# EasyEDA Pro project ProPrj_SW4_poor.epro

# Schematic Schematic1_1

## Sheets
1 CH334R: Create Date: 2024-02-01; Page Name: CH334R; Project Name: SW4_poor; Schematic Name: Schematic1; Update Date: 2024-02-01; Company: 嘉立创EDA; Page Size: A4; Version: V1.0
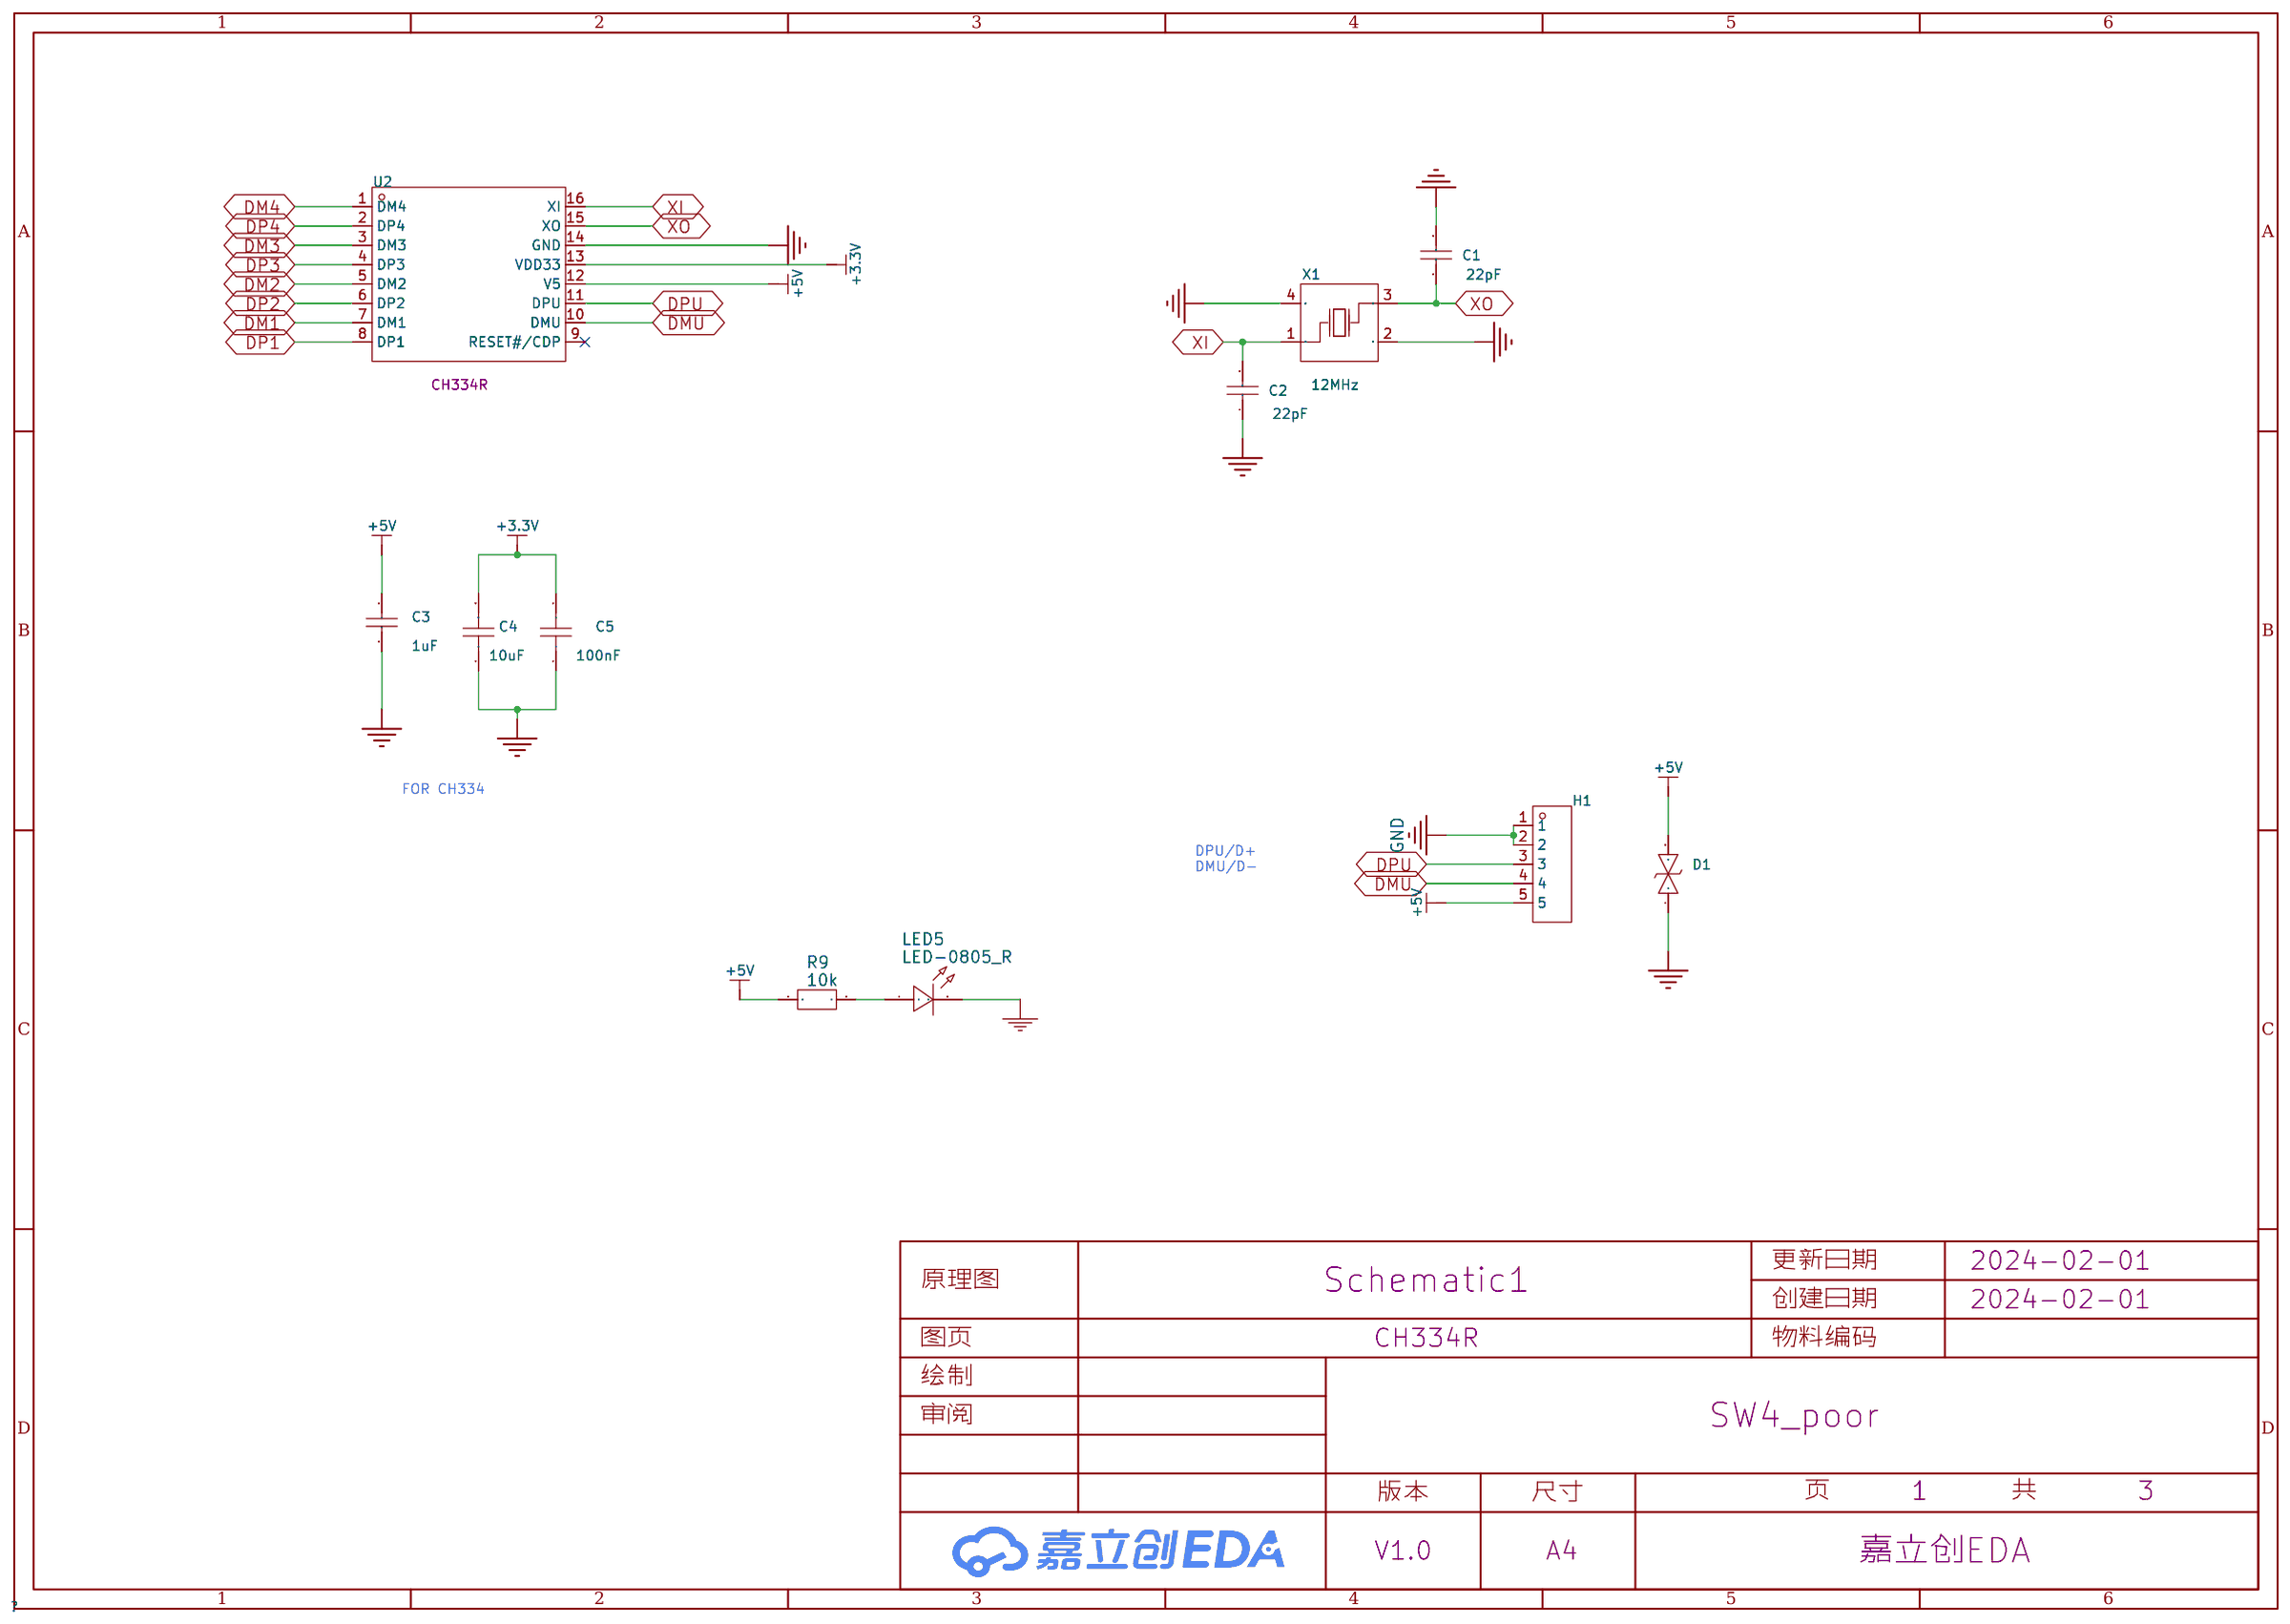
[diagram p0: CH334R]
2 E73-2G4M08S1C: Board Name: Board1_1; Create Date: 2024-02-28; Page Name: E73-2G4M08S1C; Schematic Name: Schematic1_1; Update Date: 2024-02-28
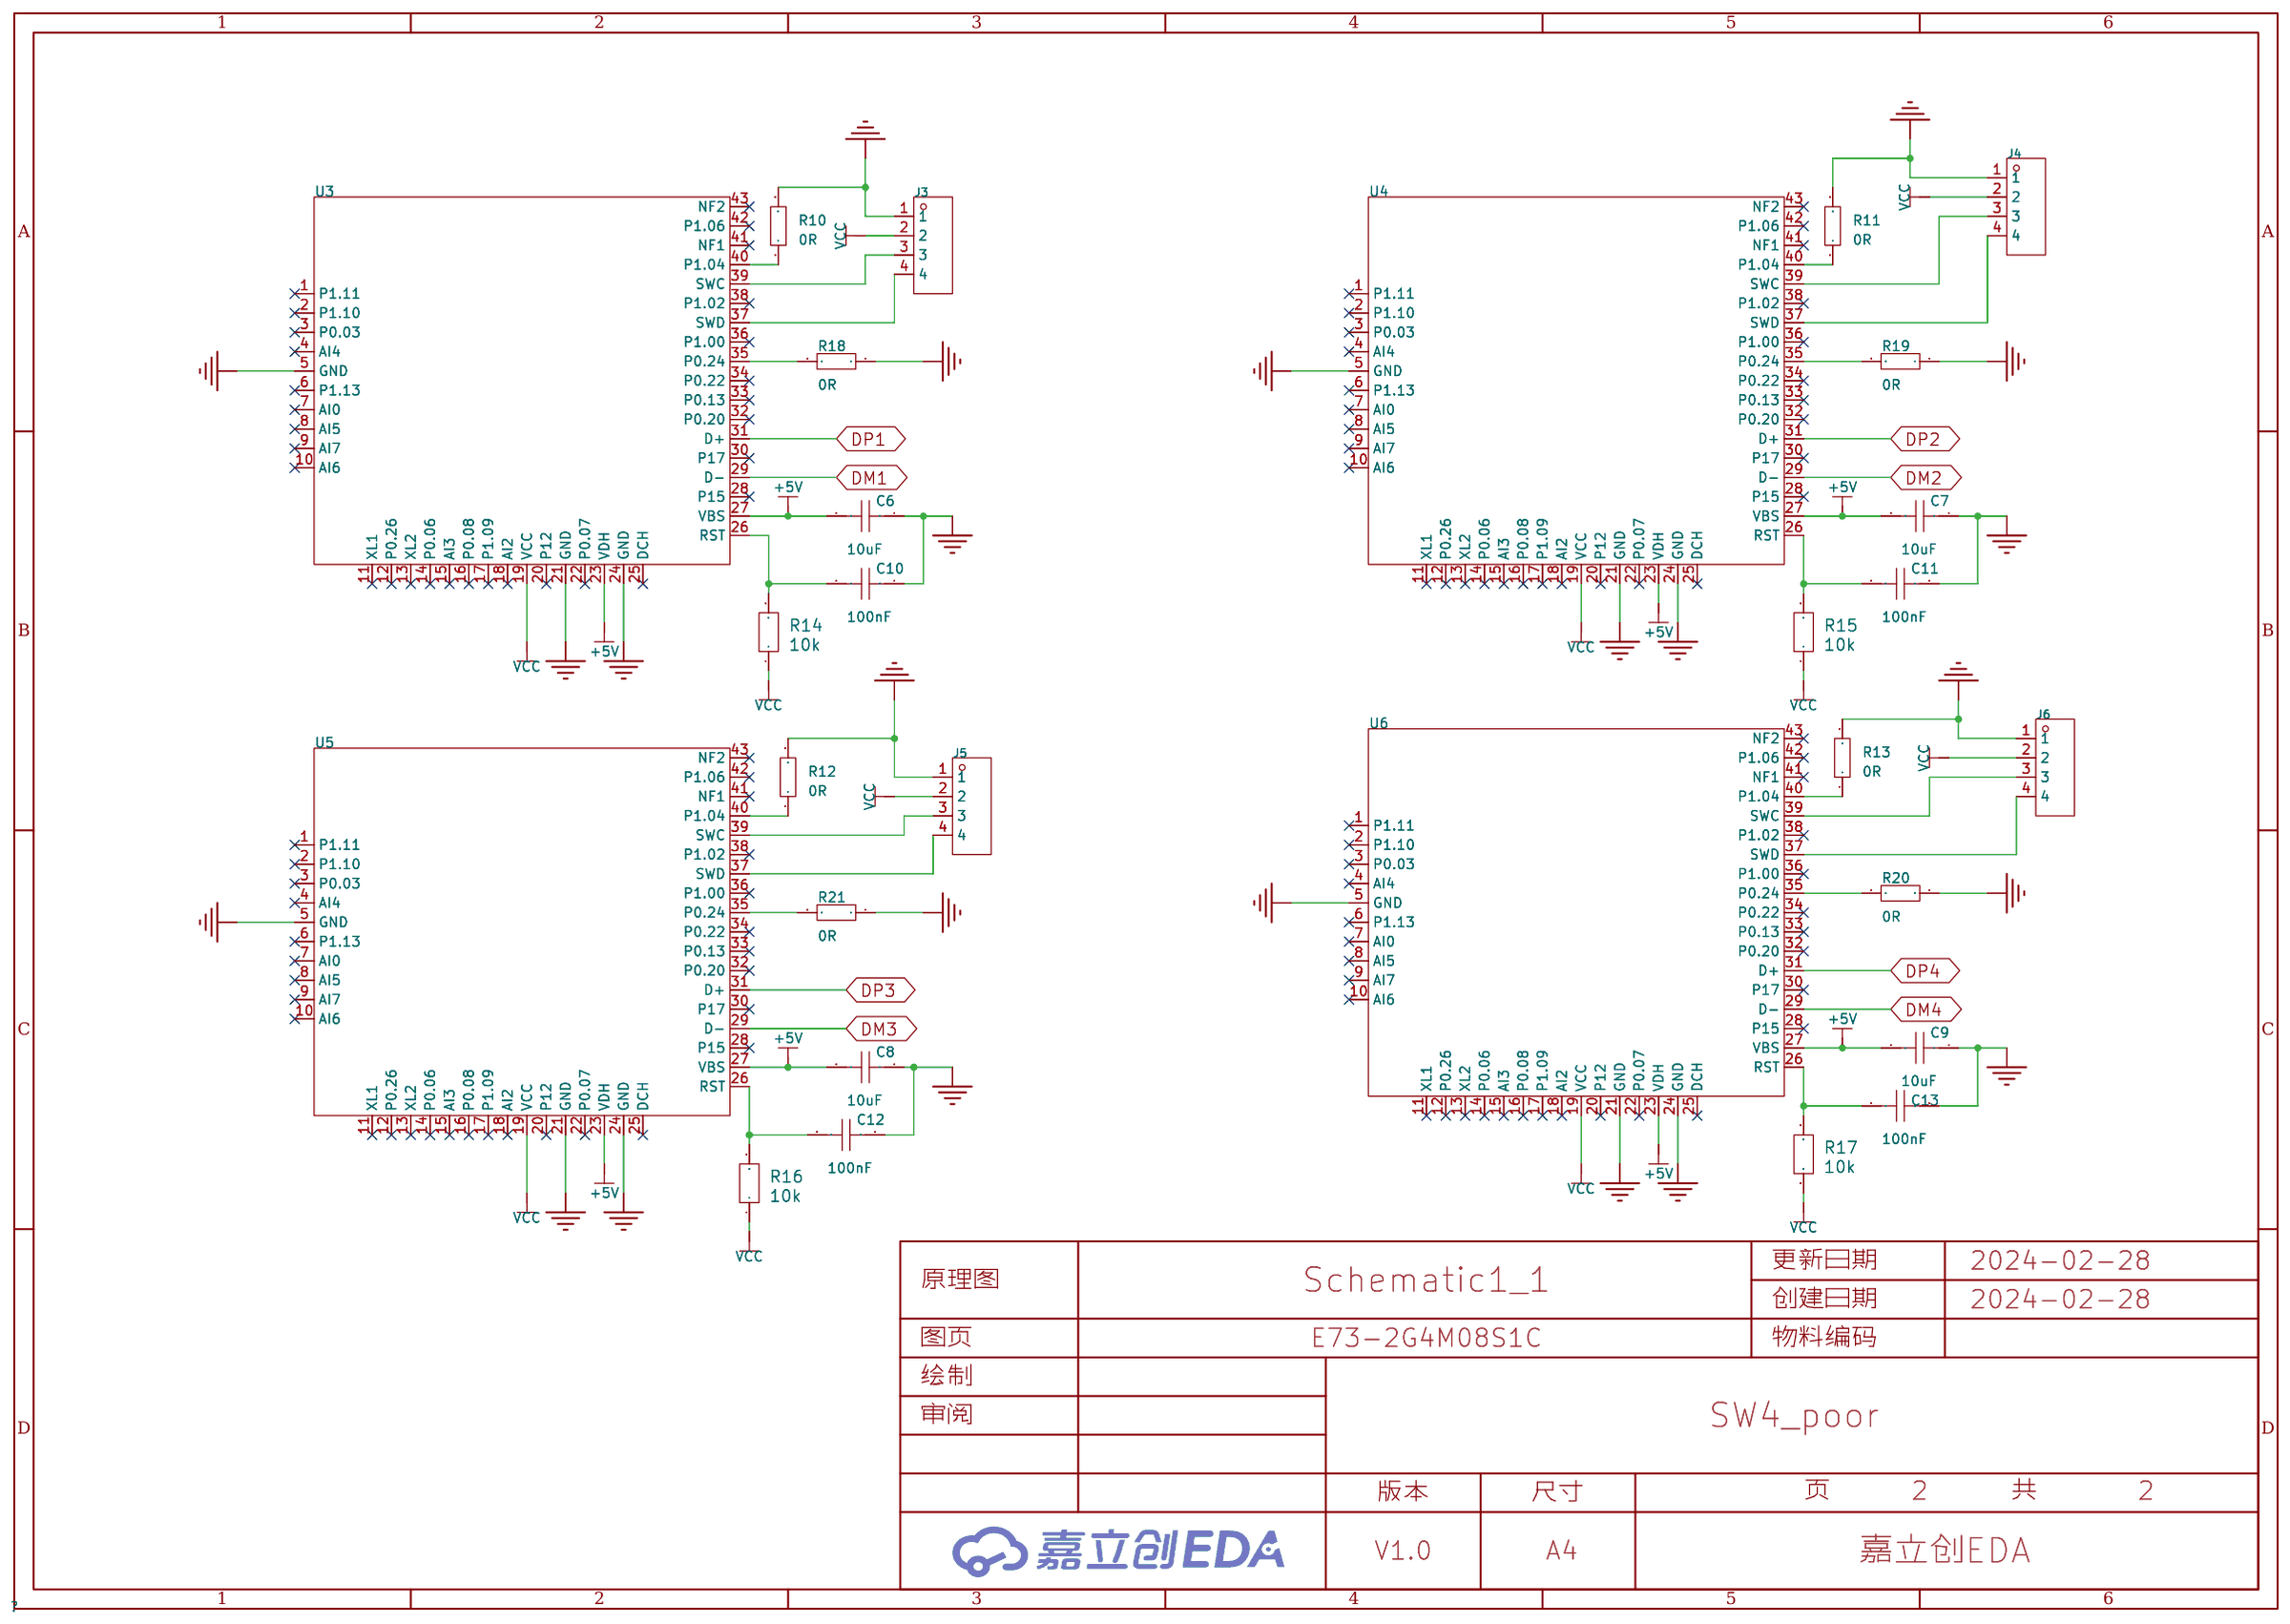
[diagram p1: E73-2G4M08S1C]

## Parts
sheet CH334R
C1  22pF  [C0603]
C2  22pF  [C0603]
C3  1uF  [C0603]
C4  10uF  [C0603]
C5  100nF  [C0603]
D1  SMF5.0CA  [SOD-123_L2.7-W1.8-LS3.7-BI]
H1  BX-PH2.0-5PWZ  [CONN-TH_5P-P2.00_BX-PH2.0-5PWZ]
LED5  LED-0805_R  [LED0805_RED]
R9  10k  [R0603]
U2  CH334R  [QSOP-16_L4.9-W3.9-P0.64-LS6.0-BL]
X1  12MHz  [OSC-SMD_4P-L3.2-W2.5-BL]
sheet E73-2G4M08S1C
C6  10uF  [C0603]
C7  10uF  [C0603]
C8  10uF  [C0603]
C9  10uF  [C0603]
C10  100nF  [C0603]
C11  100nF  [C0603]
C12  100nF  [C0603]
C13  100nF  [C0603]
J3  2.54-4P ZZDK  [CONN-TH_4P-P2.54_POGOPIN-2.5-4P-F]
J4  2.54-4P ZZDK  [CONN-TH_4P-P2.54_POGOPIN-2.5-4P-F]
J5  2.54-4P ZZDK  [CONN-TH_4P-P2.54_POGOPIN-2.5-4P-F]
J6  2.54-4P ZZDK  [CONN-TH_4P-P2.54_POGOPIN-2.5-4P-F]
R10  0R  [R0402]
R11  0R  [R0402]
R12  0R  [R0402]
R13  0R  [R0402]
R14  10k  [R0603]
R15  10k  [R0603]
R16  10k  [R0603]
R17  10k  [R0603]
R18  0R  [R0402]
R19  0R  [R0402]
R20  0R  [R0402]
R21  0R  [R0402]
U3  E73-2G4M08S1C  [WIRELM-SMD_E73-2G4M08S1C]
U4  E73-2G4M08S1C  [WIRELM-SMD_E73-2G4M08S1C]
U5  E73-2G4M08S1C  [WIRELM-SMD_E73-2G4M08S1C]
U6  E73-2G4M08S1C  [WIRELM-SMD_E73-2G4M08S1C]

## Library data of the parts
C1 C2 = CL10C220JB8NNNC: 容值:22pF;精度:±5%;额定电压:50V;材质(温度系数):C0G;; LCSC Part Name: 22pF ±5% 50V; Supplier Part: C1653; Manufacturer: SAMSUNG(三星); Supplier Footprint: 0603; JLCPCB Part Class: Basic Part; Datasheet: https://atta.szlcsc.com/upload/public/pdf/source/20160103/1457707687317.pdf; Supplier: LCSC; Tolerance: ±5%; Voltage Rated: 50V; Temperature Coefficient: C0G
C3 = CL10A105KB8NNNC: 容值:1uF;精度:±10%;额定电压:50V;材质(温度系数):X5R;; LCSC Part Name: 1uF ±10% 50V; Supplier Part: C15849; Manufacturer: SAMSUNG(三星); Supplier Footprint: 0603; JLCPCB Part Class: Basic Part; Datasheet: https://atta.szlcsc.com/upload/public/pdf/source/20160103/1457707679084.pdf; Supplier: LCSC; Tolerance: ±10%; Voltage Rated: 50V; Temperature Coefficient: X5R
C4 C6-C13 = CL10A106KP8NNNC: 容值:10uF;精度:±10%;额定电压:10V;材质(温度系数):X5R;; LCSC Part Name: 10uF ±10% 10V; Supplier Part: C19702; Manufacturer: SAMSUNG(三星); Supplier Footprint: 0603; JLCPCB Part Class: Basic Part; Datasheet: https://atta.szlcsc.com/upload/public/pdf/source/20160103/1457707703378.pdf; Supplier: LCSC; Tolerance: ±10%; Voltage Rated: 10V; Temperature Coefficient: X5R
C5 = CC0603KRX7R9BB104: 容值:100nF;精度:±10%;额定电压:50V;材质(温度系数):X7R;; LCSC Part Name: 100nF ±10% 50V; Supplier Part: C14663; Manufacturer: YAGEO(国巨); Supplier Footprint: 0603; JLCPCB Part Class: Basic Part; Datasheet: https://atta.szlcsc.com/upload/public/pdf/source/20170116/1484561234239.pdf; Supplier: LCSC; Tolerance: ±10%; Voltage Rated: 50V; Temperature Coefficient: X7R
D1 = SMF5.0CA: 极性:双向;反向截止电压(Vrwm):5V;击穿电压:6.4V;反向漏电流(Ir):800uA;峰值脉冲电流(Ipp)@10/1000μs:21.7A;最大钳位电压:9.2V;; LCSC Part Name: 双向 Vrwm:5V; Supplier Part: C435453; Manufacturer: AnBon(安邦); Supplier Footprint: SOD-123; JLCPCB Part Class: Extended Part; Datasheet: https://atta.szlcsc.com/upload/public/pdf/source/20191009/C435453_6D1091435A92BAD2FCEBAFDAD46121CC.pdf; Supplier: LCSC; Polarity: 双向; Reverse Stand-Off Voltage (Vrwm): 5V; Breakdown Voltage (Min): 6.4V; Breakdown Voltage (Max): 7.25V; Reverse Leakage Current (Ir): 800uA; Peak Pulse Current (Ipp)@10/1000μs: 21.7A; Maximum Clamping Voltage: 9.2V; Peak Pulse Power Dissipation (Ppp)@10/1000μs: 200W; Breakdown Voltage: 6.4V
H1 = BX-PH2.0-5PWZ: 插针结构:1x5P;间距:2mm;安装方式:弯插;参考系列:PH;总PIN数:5P;排数:1;每排PIN数:5;行距:-;额定电流:2A;触头材质:黄铜;触头镀层:锡;工作温度范围:-25℃~+85℃;; Supplier Part: C18077756; Manufacturer: Bossie(博锡); Supplier Footprint: 弯插,P=2mm; Datasheet: https://atta.szlcsc.com/upload/public/pdf/source/20231017/425E996C8D405406F1741D45DB812287.pdf; Supplier: LCSC; Pins Structure: 1x5P; Pitch: 2mm; Mounting Style: 弯插; Reference Series: PH; Number of Pins: 5P; Number of Rows: 1; Number of PINs Per Row: 5; Current Rating (Max): 2A; Contact Material: 黄铜; Contact Plating: 锡; Operating Temperature Range: -25℃~+85℃
LED5 = LED-0805_R: 3DModel: LED0805_Red; Manufacturer: EVERLIGHT(台湾亿光); Manufacturer Part: 17-21SURC/S530-A3/TR8; Supplier Part: C72037
R9 R14-R17 = 1k: link: https://item.szlcsc.com/142685.html; 3DModel: R0805_L2.0-W1.3-H0.6
U2 = CH334R: Supplier Part: C4154405; Manufacturer: WCH(南京沁恒); Supplier Footprint: QSOP-16-150mil; JLCPCB Part Class: 扩展库; Supplier: LCSC
X1 = X322512MOB4SI: 晶振类型:贴片无源晶振;频率:12MHz;频率公差:±10ppm;频率稳定度:±30ppm;负载电容:12pF;工作温度:-40℃~+85℃;; LCSC Part Name: 12MHz ±10ppm 12pF; Supplier Part: C70565; Manufacturer: YXC(扬兴晶振); Supplier Footprint: SMD3225-4P; JLCPCB Part Class: Extended Part; Datasheet: https://atta.szlcsc.com/upload/public/pdf/source/20210329/C112971_1F611BDC486E193C1706F6D8EB5AA189.pdf; Supplier: LCSC; Crystal Type: 贴片无源晶振; Frequency Tolerance: ±10ppm; Frequency Stability: ±30ppm; Load Capacitance: 12pF; Operating Temperature: -40℃~+85℃
J3-J6 = 2.54-4P ZZDK: 插针结构:1x4P;间距:2.5mm;安装方式:直插;总PIN数:4P;排数:1;每排PIN数:4;参考系列:XH;额定电流:3A;触头材质:黄铜;触头镀层:锡;工作温度范围:-25℃~+85℃;; LCSC Part Name: 1x4P 间距:2.5mm 直插 系列:XH; Supplier Part: C18185651; Manufacturer: SHOU HAN(首韩); Supplier Footprint: 插件,P=2.5mm; JLCPCB Part Class: 扩展库; Datasheet: https://atta.szlcsc.com/upload/public/pdf/source/20230919/5CCBE7408303C792D3A62491FEFF5508.pdf; Supplier: LCSC; Pins Structure: 1x4P; Pitch: 2.5mm; Mounting Style: 直插; Number of Pins: 4P; Number of Rows: 1; Number of PINs Per Row: 4; Reference Series: XH; Current Rating (Max): 3A; Contact Material: 黄铜; Contact Plating: 锡; Operating Temperature Range: -25℃~+85℃
R10-R13 R18-R21 = Res_0603: Supplier Footprint: 0603
U3-U6 = E73-2G4M08S1C: nRF52840 BLE Module 低功耗蓝牙; Supplier Part: C356849; Manufacturer: EBYTE(亿佰特); Supplier Footprint: Module; JLCPCB Part Class: 扩展库; Datasheet: https://atta.szlcsc.com/upload/public/pdf/source/20190802/C356849_057FD2ABDA7635054C2E243A545E6C9F.pdf; Supplier: LCSC

## Nets
+3.3V: C4.2 C5.2 U2.13(VDD33)
+5V: C3.2 C6.2 C7.2 C8.2 C9.2 D1.2 H1.5 R9.1 U2.12(V5) U3.23(VDH) U3.27(VBS) U4.23(VDH) U4.27(VBS) U5.23(VDH) U5.27(VBS) U6.23(VDH) U6.27(VBS)
GND: C1.2 C2.1 C3.1 C4.1 C5.1 C6.1 C7.1 C8.1 C9.1 C10.1 C11.1 C12.1 C13.1 D1.1 H1.1 H1.2 J3.1 J4.1 J5.1 J6.1 LED5.2 R10.2 R11.2 R12.2 R13.2 R18.1 R19.1 R20.1 R21.1 U2.14(GND) U3.5(GND) U3.21(GND) U3.24(GND) U4.5(GND) U4.21(GND) U4.24(GND) U5.5(GND) U5.21(GND) U5.24(GND) U6.5(GND) U6.21(GND) U6.24(GND) X1.2(GND) X1.4(GND)
VCC: J3.2 J4.2 J5.2 J6.2 R14.1 R15.1 R16.1 R17.1 U3.19(VCC) U4.19(VCC) U5.19(VCC) U6.19(VCC)
DM1: U2.7(DM1) U3.29(D-)
DM2: U2.5(DM2) U4.29(D-)
DM3: U2.3(DM3) U5.29(D-)
DM4: U2.1(DM4) U6.29(D-)
DMU: H1.4 U2.10(DMU)
DP1: U2.8(DP1) U3.31(D+)
DP2: U2.6(DP2) U4.31(D+)
DP3: U2.4(DP3) U5.31(D+)
DP4: U2.2(DP4) U6.31(D+)
DPU: H1.3 U2.11(DPU)
XI: C2.2 U2.16(XI) X1.1(OSC1)
XO: C1.1 U2.15(XO) X1.3(OSC2)
$1N3543: LED5.1 R9.2
$2N2129: J3.4 U3.37(SWD)
$2N2133: J3.3 U3.39(SWC)
$2N2154: J5.4 U5.37(SWD)
$2N2162: J5.3 U5.39(SWC)
$2N2167: J4.4 U4.37(SWD)
$2N2171: J4.3 U4.39(SWC)
$2N2176: J6.4 U6.37(SWD)
$2N2180: J6.3 U6.39(SWC)
Net-(C10-2): C10.2 R14.2 U3.26(RST)
Net-(C11-2): C11.2 R15.2 U4.26(RST)
Net-(C12-2): C12.2 R16.2 U5.26(RST)
Net-(C13-2): C13.2 R17.2 U6.26(RST)
Net-(R10-1): R10.1 U3.40(P1.04)
Net-(R11-1): R11.1 U4.40(P1.04)
Net-(R12-1): R12.1 U5.40(P1.04)
Net-(R13-1): R13.1 U6.40(P1.04)
Net-(R18-2): R18.2 U3.35(P0.24)
Net-(R19-2): R19.2 U4.35(P0.24)
Net-(R20-2): R20.2 U6.35(P0.24)
Net-(R21-2): R21.2 U5.35(P0.24)

Not connected (* = marked no-connect by the designer): U2 9(RESET#/CDP)*; U3 1(P1.11)* 2(P1.10)* 3(P0.03)* 4(AI4)* 6(P1.13)* 7(AI0)* 8(AI5)* 9(AI7)* 10(AI6)* 11(XL1)* 12(P0.26)* 13(XL2)* 14(P0.06)* 15(AI3)* 16(P0.08)* 17(P1.09)* 18(AI2)* 20(P12)* 22(P0.07)* 25(DCH)* 28(P15)* 30(P17)* 32(P0.20)* 33(P0.13)* 34(P0.22)* 36(P1.00)* 38(P1.02)* 41(NF1)* 42(P1.06)* 43(NF2)*; U4 1(P1.11)* 2(P1.10)* 3(P0.03)* 4(AI4)* 6(P1.13)* 7(AI0)* 8(AI5)* 9(AI7)* 10(AI6)* 11(XL1)* 12(P0.26)* 13(XL2)* 14(P0.06)* 15(AI3)* 16(P0.08)* 17(P1.09)* 18(AI2)* 20(P12)* 22(P0.07)* 25(DCH)* 28(P15)* 30(P17)* 32(P0.20)* 33(P0.13)* 34(P0.22)* 36(P1.00)* 38(P1.02)* 41(NF1)* 42(P1.06)* 43(NF2)*; U5 1(P1.11)* 2(P1.10)* 3(P0.03)* 4(AI4)* 6(P1.13)* 7(AI0)* 8(AI5)* 9(AI7)* 10(AI6)* 11(XL1)* 12(P0.26)* 13(XL2)* 14(P0.06)* 15(AI3)* 16(P0.08)* 17(P1.09)* 18(AI2)* 20(P12)* 22(P0.07)* 25(DCH)* 28(P15)* 30(P17)* 32(P0.20)* 33(P0.13)* 34(P0.22)* 36(P1.00)* 38(P1.02)* 41(NF1)* 42(P1.06)* 43(NF2)*; U6 1(P1.11)* 2(P1.10)* 3(P0.03)* 4(AI4)* 6(P1.13)* 7(AI0)* 8(AI5)* 9(AI7)* 10(AI6)* 11(XL1)* 12(P0.26)* 13(XL2)* 14(P0.06)* 15(AI3)* 16(P0.08)* 17(P1.09)* 18(AI2)* 20(P12)* 22(P0.07)* 25(DCH)* 28(P15)* 30(P17)* 32(P0.20)* 33(P0.13)* 34(P0.22)* 36(P1.00)* 38(P1.02)* 41(NF1)* 42(P1.06)* 43(NF2)*

## Notes on the sheets
sheet 1
- FOR CH334
- DPU/D+
  DMU/D-

# Board PCB1_1
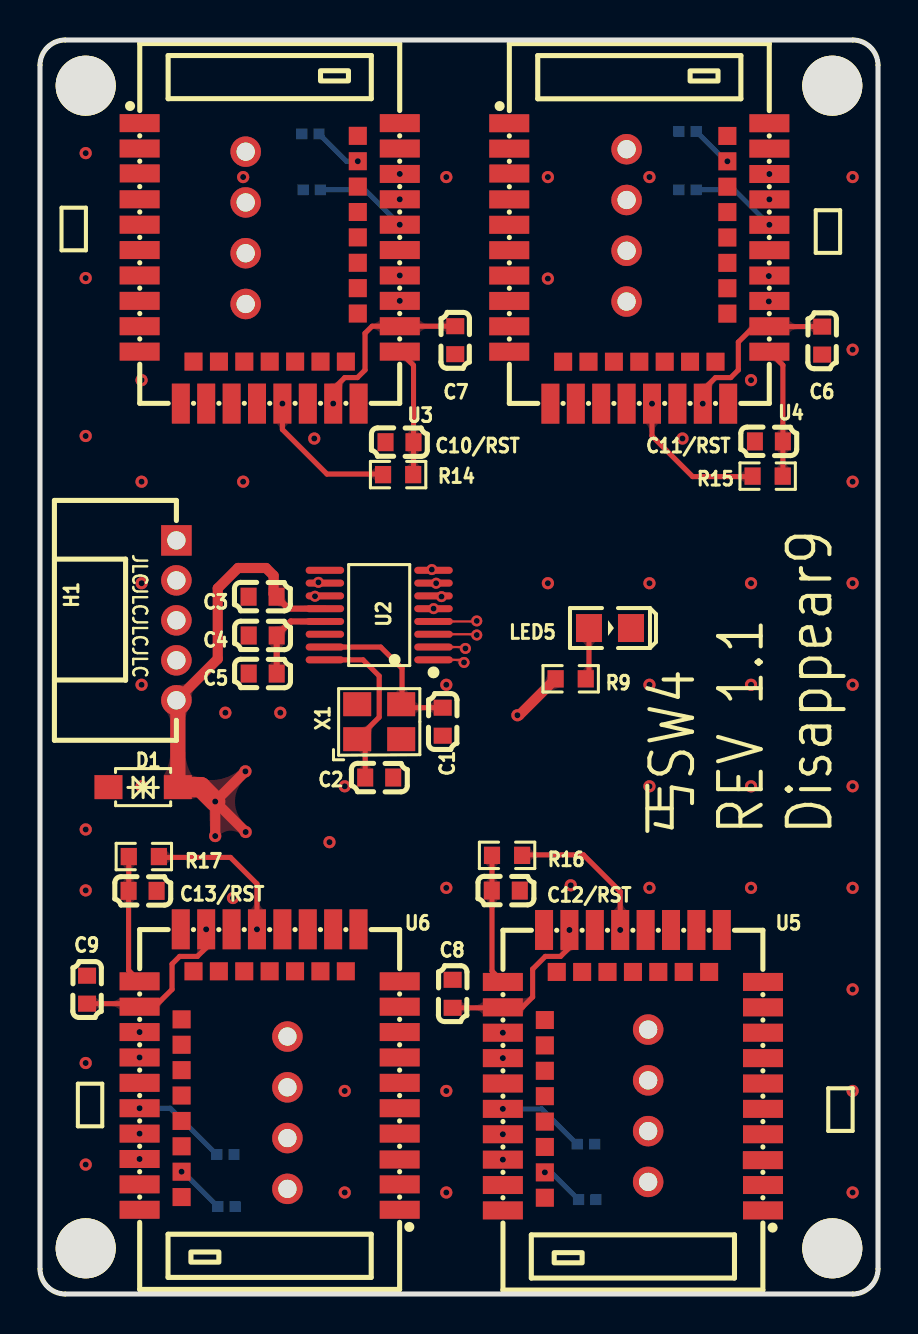
[diagram p2: board, top side]
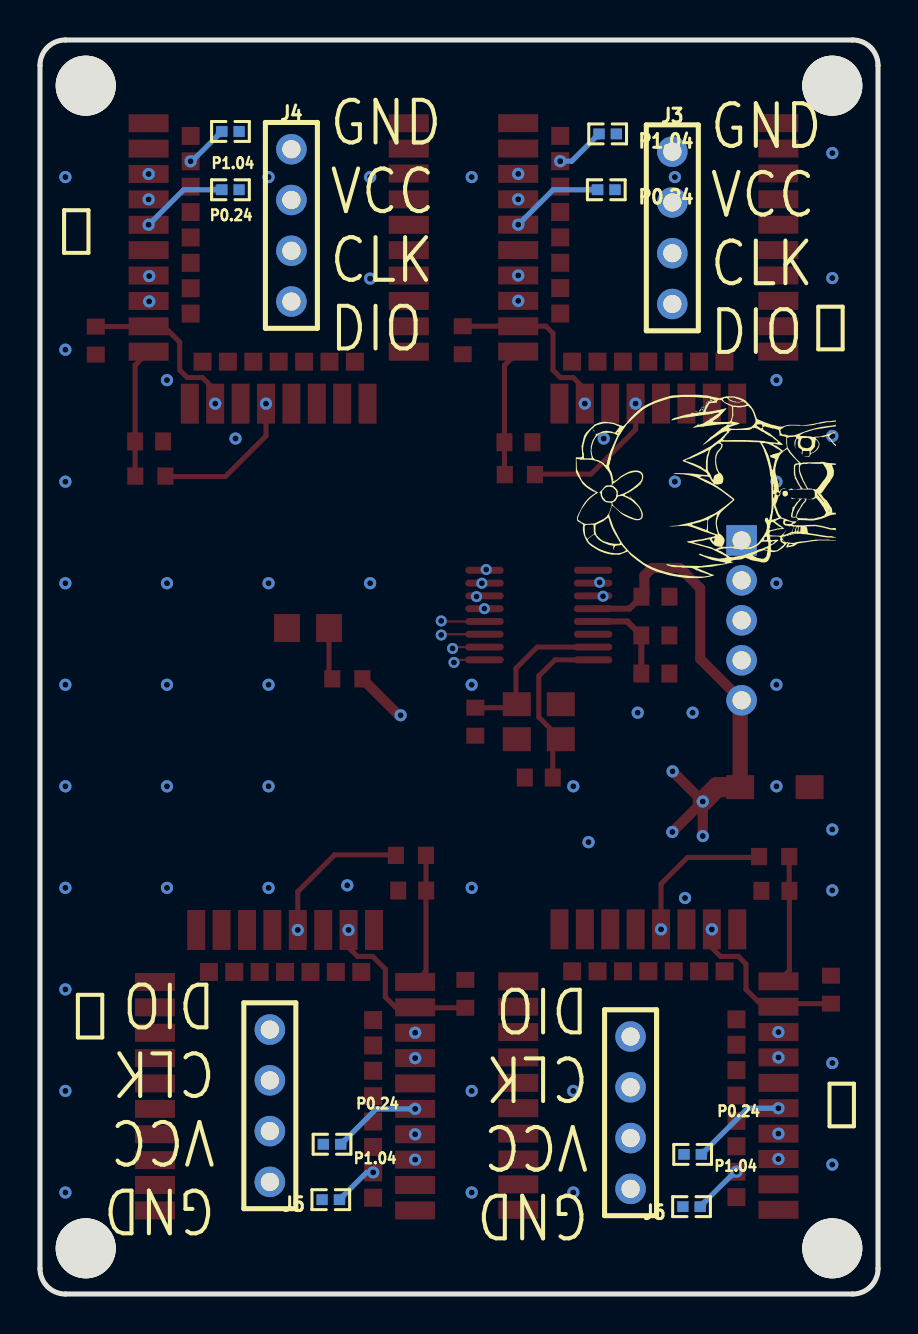
[diagram p3: board, bottom side, seen from below]

Outline 41.91 x 62.74 mm; copper layers: Top Layer, Inner1, Inner2, Bottom Layer. Coordinates in mm from the lower left corner of the outline.
Outline path: 0,61.47 0,1.27 arc(0.37,0.37) 1.27,0 40.64,0 arc(41.54,0.37) 41.91,1.27 41.91,61.47 arc(41.54,62.37) 40.64,62.74 1.27,62.74 arc(0.37,62.37) 0,61.47
Stack: Top Layer 0.035mm 外层铜厚1oz / Dielectric1 0.2104mm 7628 RC49% 8.6mil / Inner1 0.0152mm 内层铜厚 / Dielectric2 1.065mm 1.1mm H/HOZ 含铜 / Inner2 0.0152mm 内层铜厚 / Dielectric3 0.2104mm 7628 RC49% 8.6mil / Bottom Layer 0.035mm 外层铜厚1oz

## Design rules (mm)
net DM4: DP4
net DP4: DP4
net DM3: DP3
net DP3: DP3
net DM2: DP2
net DP2: DP2
net DM1: DP1
net DP1: DP1
net DPU: DM
net DMU: DM
template: 自定义配置
spacing copperThickness1oz (default): track to track 0.102, other pairs 0.152 to 0.3
spacing copperThickness2oz: track to track 0.203, other pairs 0.152 to 0.3
track width copperThickness1oz (default): min 0.127, default 0.254, max 2.54
track width copperThickness2oz: min 0.203, default 0.254, max 2.54
differential pair differentialPair (default): width min 0.076, default 0.254, max 2.54; gap min 0.203, default 0.203
via viaSize (default): diameter min 0.5, default 0.61, max 10; hole min 0.3, default 0.305, max 6.299

## Placement (name value [footprint] x y rotation side)
C1  22pF  [C0603]  20.14 28.63 270 top
C2  22pF  [C0603]  16.96 25.84 180 top
C3  1uF  [C0603]  11.13 34.89 0 top
C4  10uF  [C0603]  11.14 32.95 0 top
C5  100nF  [C0603]  11.14 31.04 0 top
C6  10uF  [C0603]  39.12 47.7 90 top
C7  10uF  [C0603]  20.77 47.72 90 top
C8  10uF  [C0603]  20.64 15.02 270 top
C9  10uF  [C0603]  2.35 15.23 270 top
C10/RST  100nF  [C0603]  17.98 42.62 0 top
C11/RST  100nF  [C0603]  36.45 42.65 0 top
C12/RST  100nF  [C0603]  23.29 20.18 180 top
C13/RST  100nF  [C0603]  5.13 20.17 180 top
D1  SMF5.0CA  [SOD-123_L2.7-W1.8-LS3.7-BI]  5.16 25.36 0 top
H1  BX-PH2.0-5PWZ  [CONN-TH_5P-P2.00_BX-PH2.0-5PWZ]  6.82 33.7 270 top
J3  2.54-4P ZZDK  [CONN-TH_4P-P2.54_POGOPIN-2.5-4P-F]  10.29 53.34 270 bottom
J4  2.54-4P ZZDK  [CONN-TH_4P-P2.54_POGOPIN-2.5-4P-F]  29.34 53.46 270 bottom
J5  2.54-4P ZZDK  [CONN-TH_4P-P2.54_POGOPIN-2.5-4P-F]  30.41 9.42 90 bottom
J6  2.54-4P ZZDK  [CONN-TH_4P-P2.54_POGOPIN-2.5-4P-F]  12.37 9.07 90 bottom
LED5  LED-0805_R  [LED0805_RED]  28.51 33.32 0 top
NOREF  -  [Pad_e9]  39.62 2.29 0 top
NOREF#2  -  [Pad_e232]  2.29 60.45 0 top
NOREF#3  -  [Pad_e233]  2.29 2.29 0 top
NOREF#4  -  [Pad_e13]  39.62 60.45 0 top
P0.24  -  [R0402]  32.38 55.24 0 bottom
P0.24#2  -  [R0402]  9.27 6.98 180 bottom
P0.24#3  -  [R0402]  27.3 7.49 180 bottom
P0.24#4  -  [R0402]  13.59 55.24 0 bottom
P1.04  -  [R0402]  13.52 58.04 180 bottom
P1.04#2  -  [R0402]  32.38 58.16 180 bottom
P1.04#3  -  [R0402]  27.37 4.72 0 bottom
P1.04#4  -  [R0402]  9.33 4.37 0 bottom
R9  10k  [R0603]  26.54 30.78 0 top
R14  10k  [R0603]  17.91 40.99 0 top
R15  10k  [R0603]  36.39 40.92 0 top
R16  10k  [R0603]  23.36 21.95 180 top
R17  10k  [R0603]  5.19 21.89 180 top
U2  CH334R  [QSOP-16_L4.9-W3.9-P0.64-LS6.0-BL]  16.96 33.97 90 top
U3  E73-2G4M08S1C  [WIRELM-SMD_E73-2G4M08S1C]  11.49 51.56 180 top
U4  E73-2G4M08S1C  [WIRELM-SMD_E73-2G4M08S1C]  29.97 51.56 180 top
U5  E73-2G4M08S1C  [WIRELM-SMD_E73-2G4M08S1C]  29.65 11.2 0 top
U6  E73-2G4M08S1C  [WIRELM-SMD_E73-2G4M08S1C]  11.49 11.23 0 top
X1  12MHz  [OSC-SMD_4P-L3.2-W2.5-BL]  16.96 28.63 0 top

## Footprints (pads in the part's own frame, mm; a bottom-side part is the same pattern mirrored in y, then rotated)
C0603
  rect 0.8x0.9 smd: 1(-0.7,0) 2(0.7,0)
CONN-TH_4P-P2.54_POGOPIN-2.5-4P-F
  round 1.524 hole 0.914: 1(-3.81,0) 2(-1.27,0) 3(1.27,0) 4(3.81,0)
CONN-TH_5P-P2.00_BX-PH2.0-5PWZ
  rect 1.524x1.524 hole 0.914: 1(-4,0)
  round 1.524 hole 0.914: 2(-2,0) 3(0,0) 4(2,0) 5(4,0)
LED0805_RED
  rect 1.3x1.399 smd: 1(-1.05,0) 2(1.05,0)
OSC-SMD_4P-L3.2-W2.5-BL
  rect 1.4x1.2 smd: 1(-1.1,-0.875) 2(1.1,-0.875) 3(1.1,0.875) 4(-1.1,0.875)
Pad_e9
  round 3 hole 3: 44(0,0)
Pad_e13
  round 3 hole 3: 44(0,0)
Pad_e232
  round 3 hole 3: 44(0,0)
Pad_e233
  round 3 hole 3: 44(0,0)
QSOP-16_L4.9-W3.9-P0.64-LS6.0-BL
  oval 0.35x1.921 smd: 1(-2.24,-2.716) 2(-1.6,-2.716) 3(-0.96,-2.716) 4(-0.32,-2.716) 5(0.32,-2.716) 6(0.96,-2.716) 7(1.6,-2.716) 8(2.24,-2.716) 9(2.24,2.716) 10(1.6,2.716) 11(0.96,2.716) 12(0.32,2.716) 13(-0.32,2.716) 14(-0.96,2.716) 15(-1.6,2.716) 16(-2.24,2.716)
R0402
  rect 0.566x0.54 smd: 1(-0.433,0) 2(0.433,0)
R0603
  rect 0.806x0.864 smd: 1(-0.753,0) 2(0.753,0)
SOD-123_L2.7-W1.8-LS3.7-BI
  rect 1.4x1.2 smd: 1(-1.735,0) 2(1.735,0)
WIRELM-SMD_E73-2G4M08S1C
  rect 2x0.9 smd: 1(6.505,-7.015) 2(6.505,-5.745) 3(6.5,-4.5) 4(6.505,-3.205) 5(6.505,-1.935) 6(6.505,-0.665) 7(6.505,0.605) 8(6.505,1.875) 9(6.505,3.145) 10(6.505,4.415) 26(-6.505,4.415) 27(-6.505,3.145) 29(-6.505,1.875) 31(-6.505,0.605) 33(-6.505,-0.665) 35(-6.505,-1.935) 37(-6.505,-3.205) 39(-6.505,-4.475) 41(-6.505,-5.745) 43(-6.505,-7.015)
  rect 0.9x2 smd: 11(4.445,7.015) 13(3.175,7.015) 15(1.905,7.015) 17(0.635,7.015) 19(-0.635,7.015) 21(-1.905,7.015) 23(-3.175,7.015) 25(-4.445,7.015)
  rect 0.9x0.9 smd: 12(3.81,4.915) 14(2.54,4.915) 16(1.27,4.915) 18(0,4.915) 20(-1.27,4.915) 22(-2.54,4.915) 24(-3.81,4.915) 28(-4.405,2.51) 30(-4.405,1.24) 32(-4.405,-0.03) 34(-4.405,-1.3) 36(-4.405,-2.57) 38(-4.405,-3.84) 40(-4.405,-5.11) 42(-4.405,-6.38)

## Nets
+3.3V: C4.2 C5.2 U2.13
+5V: C3.2 C6.2 C7.2 C8.2 C9.2 D1.2 H1.5 R9.1 U2.12 U3.23 U3.27 U4.23 U4.27 U5.23 U5.27 U6.23 U6.27
GND: C1.2 C2.1 C3.1 C4.1 C5.1 C6.1 C7.1 C8.1 C9.1 C10/RST.1 C11/RST.1 C12/RST.1 C13/RST.1 D1.1 H1.1 H1.2 J3.1 J4.1 J5.1 J6.1 LED5.2 P0.24.1 P0.24#2.1 P0.24#3.1 P0.24#4.1 P1.04.2 P1.04#2.2 P1.04#3.2 P1.04#4.2 U2.14 U3.5 U3.21 U3.24 U4.5 U4.21 U4.24 U5.5 U5.21 U5.24 U6.5 U6.21 U6.24 X1.2 X1.4
VCC: J3.2 J4.2 J5.2 J6.2 R14.1 R15.1 R16.1 R17.1 U3.19 U4.19 U5.19 U6.19
DM1: U2.7 U3.29
DM2: U2.5 U4.29
DM3: U2.3 U5.29
DM4: U2.1 U6.29
DMU: H1.4 U2.10
DP1: U2.8 U3.31
DP2: U2.6 U4.31
DP3: U2.4 U5.31
DP4: U2.2 U6.31
DPU: H1.3 U2.11
XI: C2.2 U2.16 X1.1
XO: C1.1 U2.15 X1.3
$1N3543: LED5.1 R9.2
$2N2129: J3.4 U3.37
$2N2133: J3.3 U3.39
$2N2154: J5.4 U5.37
$2N2162: J5.3 U5.39
$2N2167: J4.4 U4.37
$2N2171: J4.3 U4.39
$2N2176: J6.4 U6.37
$2N2180: J6.3 U6.39
$2N2547: P1.04.1 U3.40
$2N2679: P1.04#3.1 U5.40
$2N2691: P1.04#4.1 U6.40
$2N2703: P1.04#2.1 U4.40
$2N2930: C10/RST.2 R14.2 U3.26
$2N3006: C11/RST.2 R15.2 U4.26
$2N3080: C12/RST.2 R16.2 U5.26
$2N3154: C13/RST.2 R17.2 U6.26
$2N4136: P0.24#4.2 U3.35
$2N4263: P0.24.2 U4.35
$2N4267: P0.24#2.2 U6.35
$2N4271: P0.24#3.2 U5.35

Pads without a net: NOREF 44; NOREF#2 44; NOREF#3 44; NOREF#4 44; U2 9; U3 1 2 3 4 6 7 8 9 10 11 12 13 14 15 16 17 18 20 22 25 28 30 32 33 34 36 38 41 42 43; U4 1 2 3 4 6 7 8 9 10 11 12 13 14 15 16 17 18 20 22 25 28 30 32 33 34 36 38 41 42 43; U5 1 2 3 4 6 7 8 9 10 11 12 13 14 15 16 17 18 20 22 25 28 30 32 33 34 36 38 41 42 43; U6 1 2 3 4 6 7 8 9 10 11 12 13 14 15 16 17 18 20 22 25 28 30 32 33 34 36 38 41 42 43

## Via types
v1: diameter 0.61, hole 0.305, Top Layer to Bottom Layer, 89 vias
v2: diameter 0.551, hole 0.299, Top Layer to Bottom Layer, 8 vias
v3: diameter 0.55, hole 0.3, Top Layer to Bottom Layer, 2 vias

## Routing (per net, layer and track width the routed paths; a pad name or vN(x,y) marks a point on that pad's centre or on a via; arc(x,y) is an arc through that point)
+3.3V: length 4.6
  Top Layer w0.305: 14.25,33.65 12.54,33.65 C4.2 C5.2
+5V: length 158.3
  Top Layer w0.254: C6.2 36.49,48.4 ; 36.49,48.4 U4.27 ; 36.49,48.4 35.7,48.4 34.92,47.62 34.92,46.23 34.54,45.85 33.78,45.85 33.15,45.21 v1(33.15,44.54) ; v1(26.48,18.21) 26.48,17.33 26.03,16.89 25.27,16.89 24.64,16.26 24.64,14.86 24.12,14.34 U5.27 23.13,14.32 C8.2 ; v1(8.31,18.24) 8.31,17.33 7.87,16.89 6.98,16.89 6.6,16.51 6.6,15.24 5.74,14.37 U6.27 4.83,14.53 C9.2 ; v1(14.66,44.55) 14.66,45.27 15.24,45.85 15.88,45.85 16.26,46.23 16.26,48.07 16.61,48.42 U3.27 20.76,48.42 C7.2
  Top Layer w0.305: 14.25,34.29 12.43,34.29 C3.2
  Top Layer w0.508: H1.5 8.89,31.77 8.89,35.31 9.91,36.32 11.3,36.32 11.68,35.94 11.68,35.03 C3.2 ; v1(8.76,24.64) v1(10.29,23.11) ; v1(8.76,24.64) 10.29,26.16 ; v1(8.76,24.64) 8.76,22.99 ; R9.1 23.97,28.96 v1(23.88,28.96)
  Top Layer w0.762: D1.2 6.89,29.63 H1.5
  Top Layer w1.016: D1.2 8.04,25.36 v1(8.76,24.64)
  Inner1 w0.508: v1(8.76,24.64) 19.56,24.64 ; v1(8.76,24.64) v1(8.76,22.91) 8.76,18.7 v1(8.31,18.24) ; v1(8.76,24.64) v1(10.29,23.11) 15.19,18.21 v1(26.48,18.21) ; v1(8.76,24.64) v1(10.27,26.15) 12.95,28.83 12.95,40.13 14.73,41.91 14.73,44.48 v1(14.66,44.55) ; 19.56,24.64 22.99,24.64 33.15,34.8 v1(33.15,44.54) ; 19.56,24.64 v1(23.88,28.96)
GND:
  vias: v1(2.29,57.08) v1(2.29,50.83) v1(2.29,42.93) v1(2.29,23.24) v1(2.29,20.19) v1(2.29,11.56) v1(2.29,6.47) v1(5.08,45.72) v1(5.08,40.64) v1(5.08,35.56) v1(5.08,30.48) v1(5.08,25.4) v1(9.27,29.08) v1(9.65,19.81) v1(10.16,55.88) v1(10.16,40.64) v1(12.02,29.08) v1(13.72,42.8) v1(14.48,22.61) v1(15.24,25.4) v1(15.24,10.16) v1(15.24,5.08) v1(20.32,55.88) v1(20.32,30.48) v1(20.32,20.32) v1(20.32,10.16) v1(20.32,5.08) v1(25.4,55.88) v1(25.4,50.8) v1(25.4,35.56) v1(26.54,20.45) v1(30.48,55.88) v1(30.48,35.56) v1(30.48,30.48) v1(30.48,25.4) v1(30.48,20.32) v1(32.13,42.8) v1(35.56,45.72) v1(35.56,35.56) v1(35.56,30.48) v1(35.56,25.4) v1(35.56,20.32) v1(40.64,55.88) v1(40.64,47.24) v1(40.64,40.64) v1(40.64,35.56) v1(40.64,30.48) v1(40.64,25.4) v1(40.64,20.32) v1(40.64,15.24) v1(40.64,10.16) v1(40.64,5.08)
VCC: length 73.4
  Top Layer w0.254: v1(29.02,18.21) 29.02,20.13 27.18,21.97 24.14,21.97 R16.1 ; v1(30.61,44.54) 30.61,42.93 32.64,40.89 35.61,40.89 R15.1 ; v1(12.12,44.55) 12.12,43.25 14.35,41.02 17.13,41.02 R14.1 ; R17.1 5.99,21.84 9.52,21.84 10.85,20.52 v1(10.85,18.24)
  Inner1 w0.254: v1(10.85,18.24) 10.85,9.32 J6.2 ; v1(12.12,44.55) 12.12,52.77 J3.2 ; v1(29.02,18.21) 29.02,9.55 J5.2 ; J4.2 30.61,53.46 v1(30.61,44.54)
DM1: length 17.3
  Inner2 w0.11: v2(19.81,35.56) 18.97,35.56 18.53,36.01 18.53,37.89 19.88,39.24 19.88,48.63 18.41,50.1 v1(17.99,49.69)
DM2: length 26.6
  Inner2 w0.11: v2(19.69,34.29) 20.13,33.85 20.77,33.85 30.55,43.63 34.29,43.63 34.55,43.89 34.55,48.59 36.03,50.07 v1(36.45,49.66)
DM3: length 26.5
  Top Layer w0.11: v2(21.84,32.97) 21.81,33.01 19.68,33.01
  Inner2 w0.11: v1(23.15,13.07) 23.63,12.59 23.74,12.59 23.81,12.67 23.81,24.26 arc(23.68,24.57) 23.37,24.7 arc(23.05,24.84) 22.92,25.15 22.92,25.78 arc(23.05,26.1) 23.37,26.23 arc(23.68,26.36) 23.81,26.67 23.81,26.99 22.73,28.07 22.73,29.97 23.62,30.86 23.62,32.13 22.78,32.97 v2(21.84,32.97)
DM4: length 32.9
  Top Layer w0.11: v2(21.21,31.6) 21.08,31.73 19.68,31.73
  Inner2 w0.11: v2(21.21,31.6) 21.59,31.6 21.78,31.79 21.97,31.79 22.04,31.71 21.03,30.7 21.03,23.7 20.95,23.62 20.7,23.62 19.62,22.54 arc(19.27,22.39) 18.92,22.54 arc(18.57,22.68) 18.22,22.54 17.84,22.16 arc(17.7,21.81) 17.84,21.46 arc(17.99,21.11) 17.84,20.76 14.1,17.02 9.96,17.02 5.57,12.63 5.46,12.63 v1(4.98,13.1)
DMU: length 17.8
  Inner2 w0.11: v3(13.92,35.6) 15.42,35.6 15.64,35.82 15.64,36.62 14.97,37.29 14.41,37.29 arc(14.21,37.21) 14.12,37.01 arc(14.04,36.8) 13.84,36.72 12.89,36.72 arc(12.69,36.8) 12.6,37.01 arc(12.52,37.21) 12.31,37.29 11.08,37.29 arc(10.87,37.21) 10.79,37.01 arc(10.7,36.8) 10.5,36.72 9.55,36.72 arc(9.35,36.8) 9.26,37.01 arc(9.18,37.21) 8.98,37.29 8.73,37.29 8.44,37 8.44,32.83 8.16,32.55 7.67,32.55 H1.4
DP1: length 17.2
  Inner2 w0.11: v2(19.6,36.24) 19.21,36.24 19.02,36.06 18.92,36.06 18.84,36.13 18.84,37.76 20.19,39.11 20.19,48.76 v1(17.99,50.96)
DP2: length 26.5
  Inner2 w0.11: v1(36.45,50.93) 34.24,48.72 34.24,44.02 34.16,43.94 30.42,43.94 20.64,34.16 20.53,34.16 20.35,34.34 20.35,34.62 v2(20.08,34.89)
DP3: length 26.7
  Top Layer w0.11: v2(21.84,33.67) 21.82,33.65 19.68,33.65
  Inner2 w0.11: v1(23.15,11.8) 23.63,12.28 23.87,12.28 24.13,12.54 24.13,27.12 23.05,28.2 23.05,29.84 23.93,30.73 23.93,32.26 22.52,33.67 v2(21.84,33.67)
DP4: length 32.9
  Top Layer w0.11: 19.68,32.37 21.21,32.37 v2(21.28,32.3)
  Inner2 w0.11: v2(21.28,32.3) 21.9,32.3 22.48,31.71 21.34,30.57 21.34,23.57 21.08,23.31 20.83,23.31 14.23,16.71 10.09,16.71 5.7,12.31 5.46,12.31 v1(4.98,11.83)
DPU: length 17.8
  Inner2 w0.11: v3(13.75,34.91) 15.17,34.91 15.95,35.69 15.95,36.75 15.1,37.61 8.6,37.61 8.13,37.13 8.13,32.96 8.03,32.86 7.67,32.86 H1.3
XI: length 8.8
  Top Layer w0.254: 16.26,25.84 16.26,27.36 X1.1 16.96,28.86 16.96,30.92 16.16,31.73 14.25,31.73
XO: length 8.2
  Top Layer w0.254: 14.25,32.37 17.04,32.37 18.11,31.3 18.11,29.55 ; C1.1 18.32,29.33 18.11,29.55 ; 18.11,29.55 X1.3
$1N3543: length 2.6
  Top Layer w0.254: R9.2 27.45,30.94 LED5.1
$2N2129: length 9.9
  Inner2 w0.254: v1(17.99,54.77) 12.76,49.53 J3.4
$2N2133: length 9.3
  Inner2 w0.254: J3.3 14.03,52.07 v1(17.99,56.04)
$2N2154: length 9.4
  Inner2 w0.254: v1(23.15,7.99) 25.18,7.99 J5.4
$2N2162: length 8.9
  Inner2 w0.254: v1(23.15,6.72) 26.45,6.72 J5.3
$2N2167: length 9.3
  Inner2 w0.254: v1(36.48,54.76) 31.37,49.65 J4.4
$2N2171: length 8.7
  Inner2 w0.254: v1(36.48,56.03) 32.64,52.19 J4.3
$2N2176: length 9.4
  Inner2 w0.254: v1(4.98,8.02) 7.52,8.02 J6.4
$2N2180: length 8.9
  Inner2 w0.254: J6.3 8.79,6.75 v1(4.98,6.75)
$2N2547: length 2.5
  Bottom Layer w0.254: v1(15.89,56.67) 15.32,56.67 P1.04.1
$2N2679: length 2.3
  Bottom Layer w0.254: v1(25.25,6.09) 25.57,6.09 P1.04#3.1
$2N2691: length 2.5
  Bottom Layer w0.254: 8.89,4.37 7.15,6.12 v1(7.08,6.12)
$2N2703: length 2.2
  Bottom Layer w0.254: v1(34.38,56.67) 34.31,56.67 P1.04#2.1
$2N2930: length 6.4
  Top Layer w0.254: R14.2 18.68,41.01 C10/RST.2 18.68,46.46 U3.26
$2N3006: length 6.5
  Top Layer w0.254: U4.26 37.15,46.47 C11/RST.2 37.15,40.93 R15.2
$2N3080: length 6.6
  Top Layer w0.254: U5.26 22.61,16.15 22.61,20.2 ; 22.61,20.2 C12/RST.2 ; 22.61,20.2 R16.2
$2N3154: length 6.5
  Top Layer w0.254: R17.2 4.44,20.18 C13/RST.2 4.43,16.19 U6.26
$2N4136: length 4.7
  Bottom Layer w0.254: P0.24#4.2 16.25,55.24 v1(17.99,53.5)
$2N4263: length 4.4
  Bottom Layer w0.254: P0.24.2 34.72,55.24 v1(36.48,53.49)
$2N4267: length 4.8
  Bottom Layer w0.254: P0.24#2.2 8.83,6.98 6.51,9.29 v1(4.98,9.29)
$2N4271: length 4.5
  Bottom Layer w0.254: v1(23.15,9.26) 25.09,9.26 26.86,7.49 P0.24#3.2

## Copper pours and planes (outline as drawn; the poured copper is in the pictures)
GND on Top Layer: 0,62.74 41.91,62.74 41.91,0 0,0
GND on Bottom Layer: 0,62.74 41.91,62.74 41.91,0 0,0
GND on Inner1: 0,62.74 41.91,62.74 41.91,0 0,0
GND on Inner2: 0,62.74 41.91,62.74 41.91,0 0,0

Small or netless copper shapes (teardrops, artwork), in the pictures only: 81 on Top Layer, 16 on Bottom Layer, 24 on Inner1, 36 on Inner2

## Text on the board
Bottom Silkscreen Layer: GND / VCC / CLK / DIO | ④ | ③ | ① | ②
Top Silkscreen Layer: JLCJLCJLCJLC | ① | ② | 丐SW4 / REV 1.1 / Disappear9 | ④ | ③
